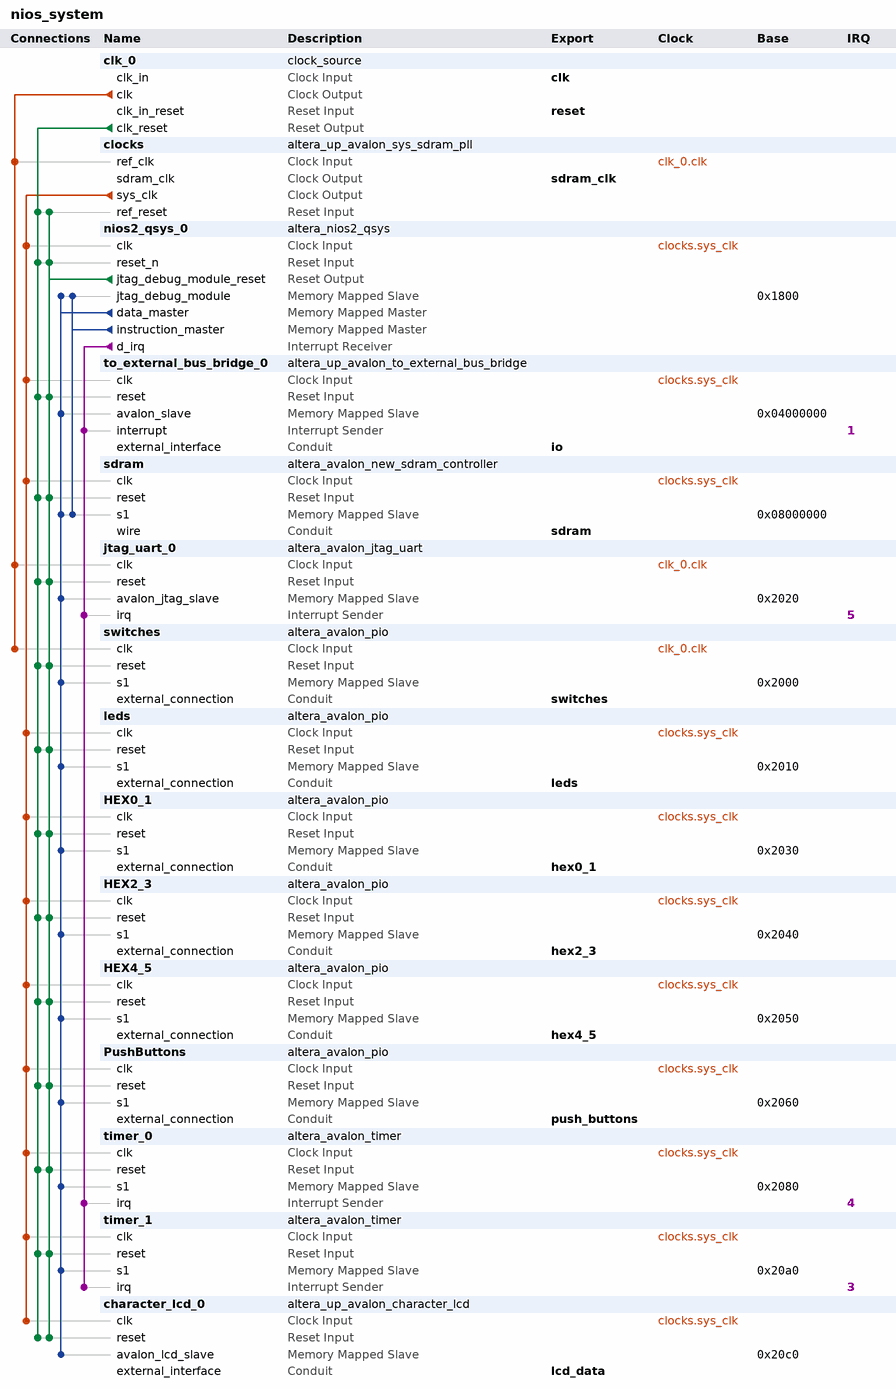
[diagram p0: system contents]
# Platform Designer (Qsys) system nios_system, Cyclone V 5CSEMA5F31C6
# Parameters at their usual value, and those the tool derives, are not listed.
package require -exact qsys 15.0
create_system nios_system
set_project_property DEVICE_FAMILY {Cyclone V}
set_project_property DEVICE 5CSEMA5F31C6

add_instance clk_0 clock_source 15.0
set_instance_parameter_value clk_0 clockFrequency 50000000

add_instance clocks altera_up_avalon_sys_sdram_pll 15.0
set_instance_parameter_value clocks CV_boards DE1-SoC
set_instance_parameter_value clocks gui_outclk 50.0
set_instance_parameter_value clocks gui_refclk 50.0

add_instance nios2_qsys_0 altera_nios2_qsys 15.0
set_instance_parameter_value nios2_qsys_0 breakSlave nios2_qsys_0.jtag_debug_module
set_instance_parameter_value nios2_qsys_0 exceptionSlave sdram.s1
set_instance_parameter_value nios2_qsys_0 icache_size 4096
set_instance_parameter_value nios2_qsys_0 impl Tiny
set_instance_parameter_value nios2_qsys_0 mmu_TLBMissExcSlave None
set_instance_parameter_value nios2_qsys_0 muldiv_divider true
set_instance_parameter_value nios2_qsys_0 resetSlave sdram.s1
set_instance_parameter_value nios2_qsys_0 resetrequest_enabled false

add_instance to_external_bus_bridge_0 altera_up_avalon_to_external_bus_bridge 15.0
set_instance_parameter_value to_external_bus_bridge_0 addr_size 64
set_instance_parameter_value to_external_bus_bridge_0 addr_size_multiplier Kbytes
set_instance_parameter_value to_external_bus_bridge_0 data_size 16

add_instance sdram altera_avalon_new_sdram_controller 15.0
set_instance_parameter_value sdram TAC 5.4
set_instance_parameter_value sdram TRCD 15.0
set_instance_parameter_value sdram TRP 15.0
set_instance_parameter_value sdram casLatency 3
set_instance_parameter_value sdram columnWidth 10
set_instance_parameter_value sdram dataWidth 16
set_instance_parameter_value sdram generateSimulationModel false
set_instance_parameter_value sdram model single_Micron_MT48LC4M32B2_7_chip
set_instance_parameter_value sdram numberOfBanks 4
set_instance_parameter_value sdram numberOfChipSelects 1
set_instance_parameter_value sdram powerUpDelay 100.0
set_instance_parameter_value sdram refreshPeriod 7.8125
set_instance_parameter_value sdram rowWidth 13

add_instance jtag_uart_0 altera_avalon_jtag_uart 15.0
set_instance_parameter_value jtag_uart_0 simInteractiveOptions NO_INTERACTIVE_WINDOWS

add_instance switches altera_avalon_pio 15.0
set_instance_parameter_value switches direction Input
set_instance_parameter_value switches width 10

add_instance leds altera_avalon_pio 15.0
set_instance_parameter_value leds direction Output
set_instance_parameter_value leds width 10

add_instance HEX0_1 altera_avalon_pio 15.0
set_instance_parameter_value HEX0_1 direction Output
set_instance_parameter_value HEX0_1 width 8

add_instance HEX2_3 altera_avalon_pio 15.0
set_instance_parameter_value HEX2_3 direction Output
set_instance_parameter_value HEX2_3 width 8

add_instance HEX4_5 altera_avalon_pio 15.0
set_instance_parameter_value HEX4_5 direction Output
set_instance_parameter_value HEX4_5 width 8

add_instance PushButtons altera_avalon_pio 15.0
set_instance_parameter_value PushButtons direction Input
set_instance_parameter_value PushButtons width 3

add_instance timer_0 altera_avalon_timer 15.0
set_instance_parameter_value timer_0 period 1
set_instance_parameter_value timer_0 periodUnits MSEC

add_instance timer_1 altera_avalon_timer 15.0
set_instance_parameter_value timer_1 period 1
set_instance_parameter_value timer_1 periodUnits MSEC

add_instance character_lcd_0 altera_up_avalon_character_lcd 15.0
set_instance_parameter_value character_lcd_0 cursor Normal

# connections
add_connection clk_0.clk clocks.ref_clk clock
add_connection clk_0.clk jtag_uart_0.clk clock
add_connection clk_0.clk switches.clk clock
add_connection clocks.sys_clk character_lcd_0.clk clock
add_connection clocks.sys_clk HEX0_1.clk clock
add_connection clocks.sys_clk HEX2_3.clk clock
add_connection clocks.sys_clk HEX4_5.clk clock
add_connection clocks.sys_clk leds.clk clock
add_connection clocks.sys_clk nios2_qsys_0.clk clock
add_connection clocks.sys_clk PushButtons.clk clock
add_connection clocks.sys_clk sdram.clk clock
add_connection clocks.sys_clk timer_0.clk clock
add_connection clocks.sys_clk timer_1.clk clock
add_connection clocks.sys_clk to_external_bus_bridge_0.clk clock
add_connection clk_0.clk_reset character_lcd_0.reset reset
add_connection clk_0.clk_reset clocks.ref_reset reset
add_connection clk_0.clk_reset HEX0_1.reset reset
add_connection clk_0.clk_reset HEX2_3.reset reset
add_connection clk_0.clk_reset HEX4_5.reset reset
add_connection clk_0.clk_reset jtag_uart_0.reset reset
add_connection clk_0.clk_reset leds.reset reset
add_connection clk_0.clk_reset nios2_qsys_0.reset_n reset
add_connection clk_0.clk_reset PushButtons.reset reset
add_connection clk_0.clk_reset sdram.reset reset
add_connection clk_0.clk_reset switches.reset reset
add_connection clk_0.clk_reset timer_0.reset reset
add_connection clk_0.clk_reset timer_1.reset reset
add_connection clk_0.clk_reset to_external_bus_bridge_0.reset reset
add_connection nios2_qsys_0.jtag_debug_module_reset character_lcd_0.reset reset
add_connection nios2_qsys_0.jtag_debug_module_reset clocks.ref_reset reset
add_connection nios2_qsys_0.jtag_debug_module_reset HEX0_1.reset reset
add_connection nios2_qsys_0.jtag_debug_module_reset HEX2_3.reset reset
add_connection nios2_qsys_0.jtag_debug_module_reset HEX4_5.reset reset
add_connection nios2_qsys_0.jtag_debug_module_reset jtag_uart_0.reset reset
add_connection nios2_qsys_0.jtag_debug_module_reset leds.reset reset
add_connection nios2_qsys_0.jtag_debug_module_reset nios2_qsys_0.reset_n reset
add_connection nios2_qsys_0.jtag_debug_module_reset PushButtons.reset reset
add_connection nios2_qsys_0.jtag_debug_module_reset sdram.reset reset
add_connection nios2_qsys_0.jtag_debug_module_reset switches.reset reset
add_connection nios2_qsys_0.jtag_debug_module_reset timer_0.reset reset
add_connection nios2_qsys_0.jtag_debug_module_reset timer_1.reset reset
add_connection nios2_qsys_0.jtag_debug_module_reset to_external_bus_bridge_0.reset reset
add_connection nios2_qsys_0.data_master character_lcd_0.avalon_lcd_slave avalon
set_connection_parameter_value nios2_qsys_0.data_master/character_lcd_0.avalon_lcd_slave baseAddress 0x20c0
add_connection nios2_qsys_0.data_master HEX0_1.s1 avalon
set_connection_parameter_value nios2_qsys_0.data_master/HEX0_1.s1 baseAddress 0x2030
add_connection nios2_qsys_0.data_master HEX2_3.s1 avalon
set_connection_parameter_value nios2_qsys_0.data_master/HEX2_3.s1 baseAddress 0x2040
add_connection nios2_qsys_0.data_master HEX4_5.s1 avalon
set_connection_parameter_value nios2_qsys_0.data_master/HEX4_5.s1 baseAddress 0x2050
add_connection nios2_qsys_0.data_master jtag_uart_0.avalon_jtag_slave avalon
set_connection_parameter_value nios2_qsys_0.data_master/jtag_uart_0.avalon_jtag_slave baseAddress 0x2020
add_connection nios2_qsys_0.data_master leds.s1 avalon
set_connection_parameter_value nios2_qsys_0.data_master/leds.s1 baseAddress 0x2010
add_connection nios2_qsys_0.data_master nios2_qsys_0.jtag_debug_module avalon
set_connection_parameter_value nios2_qsys_0.data_master/nios2_qsys_0.jtag_debug_module baseAddress 0x1800
add_connection nios2_qsys_0.data_master PushButtons.s1 avalon
set_connection_parameter_value nios2_qsys_0.data_master/PushButtons.s1 baseAddress 0x2060
add_connection nios2_qsys_0.data_master sdram.s1 avalon
set_connection_parameter_value nios2_qsys_0.data_master/sdram.s1 baseAddress 0x08000000
add_connection nios2_qsys_0.data_master switches.s1 avalon
set_connection_parameter_value nios2_qsys_0.data_master/switches.s1 baseAddress 0x2000
add_connection nios2_qsys_0.data_master timer_0.s1 avalon
set_connection_parameter_value nios2_qsys_0.data_master/timer_0.s1 baseAddress 0x2080
add_connection nios2_qsys_0.data_master timer_1.s1 avalon
set_connection_parameter_value nios2_qsys_0.data_master/timer_1.s1 baseAddress 0x20a0
add_connection nios2_qsys_0.data_master to_external_bus_bridge_0.avalon_slave avalon
set_connection_parameter_value nios2_qsys_0.data_master/to_external_bus_bridge_0.avalon_slave baseAddress 0x04000000
add_connection nios2_qsys_0.instruction_master nios2_qsys_0.jtag_debug_module avalon
set_connection_parameter_value nios2_qsys_0.instruction_master/nios2_qsys_0.jtag_debug_module baseAddress 0x1800
add_connection nios2_qsys_0.instruction_master sdram.s1 avalon
set_connection_parameter_value nios2_qsys_0.instruction_master/sdram.s1 baseAddress 0x08000000
add_connection nios2_qsys_0.d_irq jtag_uart_0.irq interrupt
set_connection_parameter_value nios2_qsys_0.d_irq/jtag_uart_0.irq irqNumber 5
add_connection nios2_qsys_0.d_irq timer_0.irq interrupt
set_connection_parameter_value nios2_qsys_0.d_irq/timer_0.irq irqNumber 4
add_connection nios2_qsys_0.d_irq timer_1.irq interrupt
set_connection_parameter_value nios2_qsys_0.d_irq/timer_1.irq irqNumber 3
add_connection nios2_qsys_0.d_irq to_external_bus_bridge_0.interrupt interrupt
set_connection_parameter_value nios2_qsys_0.d_irq/to_external_bus_bridge_0.interrupt irqNumber 1

# exported interfaces
add_interface clk clock sink
set_interface_property clk EXPORT_OF clk_0.clk_in
add_interface hex0_1 conduit end
set_interface_property hex0_1 EXPORT_OF HEX0_1.external_connection
add_interface hex2_3 conduit end
set_interface_property hex2_3 EXPORT_OF HEX2_3.external_connection
add_interface hex4_5 conduit end
set_interface_property hex4_5 EXPORT_OF HEX4_5.external_connection
add_interface io conduit end
set_interface_property io EXPORT_OF to_external_bus_bridge_0.external_interface
add_interface lcd_data conduit end
set_interface_property lcd_data EXPORT_OF character_lcd_0.external_interface
add_interface leds conduit end
set_interface_property leds EXPORT_OF leds.external_connection
add_interface push_buttons conduit end
set_interface_property push_buttons EXPORT_OF PushButtons.external_connection
add_interface reset reset sink
set_interface_property reset EXPORT_OF clk_0.clk_in_reset
add_interface sdram conduit end
set_interface_property sdram EXPORT_OF sdram.wire
add_interface sdram_clk clock source
set_interface_property sdram_clk EXPORT_OF clocks.sdram_clk
add_interface switches conduit end
set_interface_property switches EXPORT_OF switches.external_connection

set_interconnect_requirement {$system} qsys_mm.clockCrossingAdapter HANDSHAKE
set_interconnect_requirement {$system} qsys_mm.insertDefaultSlave FALSE
set_interconnect_requirement {$system} qsys_mm.maxAdditionalLatency 1

save_system nios_system.qsys
